# EAGLE design Esquema (EAGLE 9.6.2)
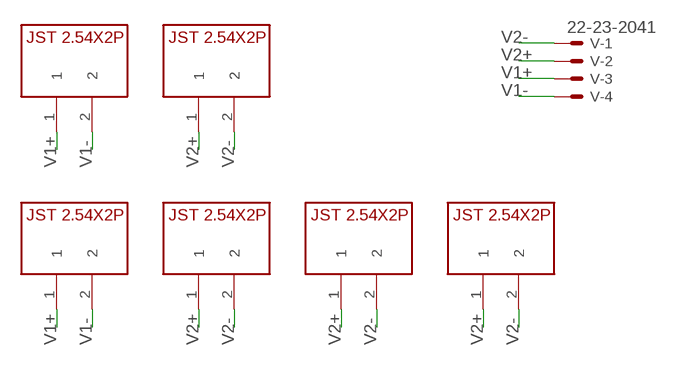
[diagram p0: schematic, sheet 1]

## Parts
U$1  JST2.54X2P  [JST2.54X2P_FOOTPRINT]
U$2  JST2.54X2P  [JST2.54X2P_FOOTPRINT]
U$3  JST2.54X2P  [JST2.54X2P_FOOTPRINT]
U$4  JST2.54X2P  [JST2.54X2P_FOOTPRINT]
U$5  JST2.54X2P  [JST2.54X2P_FOOTPRINT]
U$6  JST2.54X2P  [JST2.54X2P_FOOTPRINT]
V  22-23-2041  [22-23-2041]

## Nets
V1+: U$1.1 U$4.1 V.3
V1-: U$1.2 U$4.2 V.4
V2+: U$2.1 U$3.1 U$5.1 U$6.1 V.2
V2-: U$2.2 U$3.2 U$5.2 U$6.2 V.1

## Library data of the parts
U$1-U$6 = CRD:JST2.54X2P: Conector JST 2 pinos (2.54mm de distância entre pinos)
V = con-molex:22-23-2041: .100" (2.54mm) Center Header - 4 Pin; MF: MOLEX; MPN: 22-23-2041; OC_FARNELL: 1462920; OC_NEWARK: 38C0355

## Board
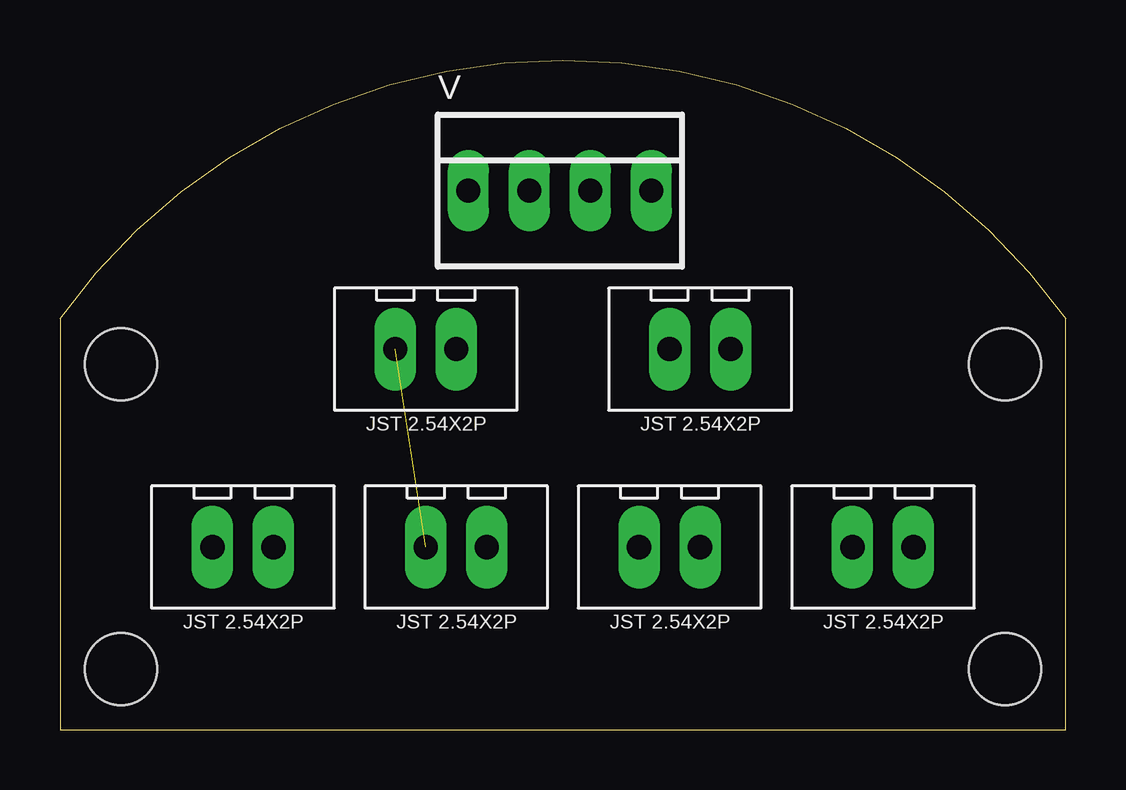
[diagram p1: board, top side]
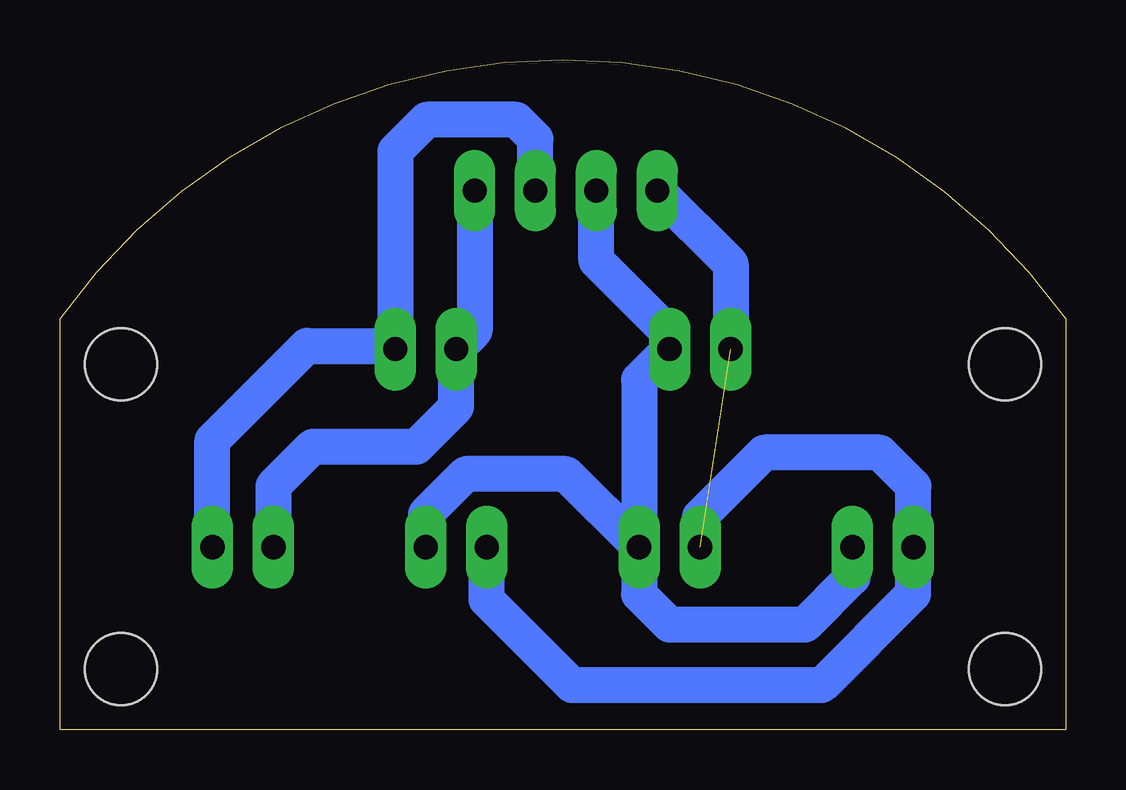
[diagram p2: board, bottom side, seen from below]

Size 41.91 x 27.93 mm. Coordinates in mm from the lower left corner, seen from the top.
Outline: 41.91,0 41.91,17.14 arc109 0,17.14 0,0 41.91,0
Copper layers (1*16): Top 0.035mm / dielectric 1.5mm / Bottom 0.035mm
Design rules "default": minimum track width 1.5mm, minimum drill 1mm, track to track 30mil, track to pad 20mil, pad to pad 6mil, via to via 6mil, smd to smd 6mil, copper to edge 40mil, drill to drill 6mil, minimum pad ring 10mil, minimum via ring 8mil, stop-mask expansion 4mil, vias tented up to drill 0mil, thermal gap 10mil
Holes 3 mm at 39.37,15.24 39.37,2.54 2.54,2.54 2.54,15.24

### Footprints (pad centres in the part's own frame; a part is rotated, then mirrored left to right if it is on the bottom)
JST2.54X2P_FOOTPRINT = drill 1.016 pad 1.27 long: 1 -1.27,0; 2 1.27,0
22-23-2041 = drill 1 long: 1 -3.81,0; 2 -1.27,0; 3 1.27,0; 4 3.81,0

### Placement (x,y rotation side)
U$1  34.29,7.62 180 top
U$2  16.51,7.62 180 top
U$3  7.62,7.62 180 top
U$4  26.67,15.88 180 top
U$5  15.24,15.88 180 top
U$6  25.4,7.62 180 top
V  20.83,22.48 0 top

### Tracks (layer width: path | path; a pad name or v marks a point on that pad's centre or on a via)
V1+
  Bottom 1.5: U$1.1 35.56,12.06 31.62,16 28.07,16 U$4.1 27.94,24.13 26.63,25.44 22.9,25.44 22.1,24.64 V.3
V1-
  Bottom 1.5: U$1.2 33.02,10.16 31.37,11.81 27.05,11.81 25.4,13.46 U$4.2 24.64,16.64 V.4
V2+
  Bottom 1.5: U$2.1 17.78,14.61 U$5.1 16.51,16.51 19.56,19.56 V.2 | U$3.1 8.89,6.35 10.86,4.38 16.51,4.38 17.78,5.65 U$2.1 | U$2.1 20.83,10.67 25,10.67 26.67,8.99 U$6.1
V2-  (1 unrouted)
  Bottom 1.5: V.1 13.97,19.43 U$5.2 | U$2.2 15.24,8.89 12.57,11.56 7.75,11.56 6.35,10.16 U$3.2 6.37,7.6 6.37,5.67 10.18,1.87 20.57,1.87 24.13,5.42 U$6.2